# Altium project driver_display.PrjPcb
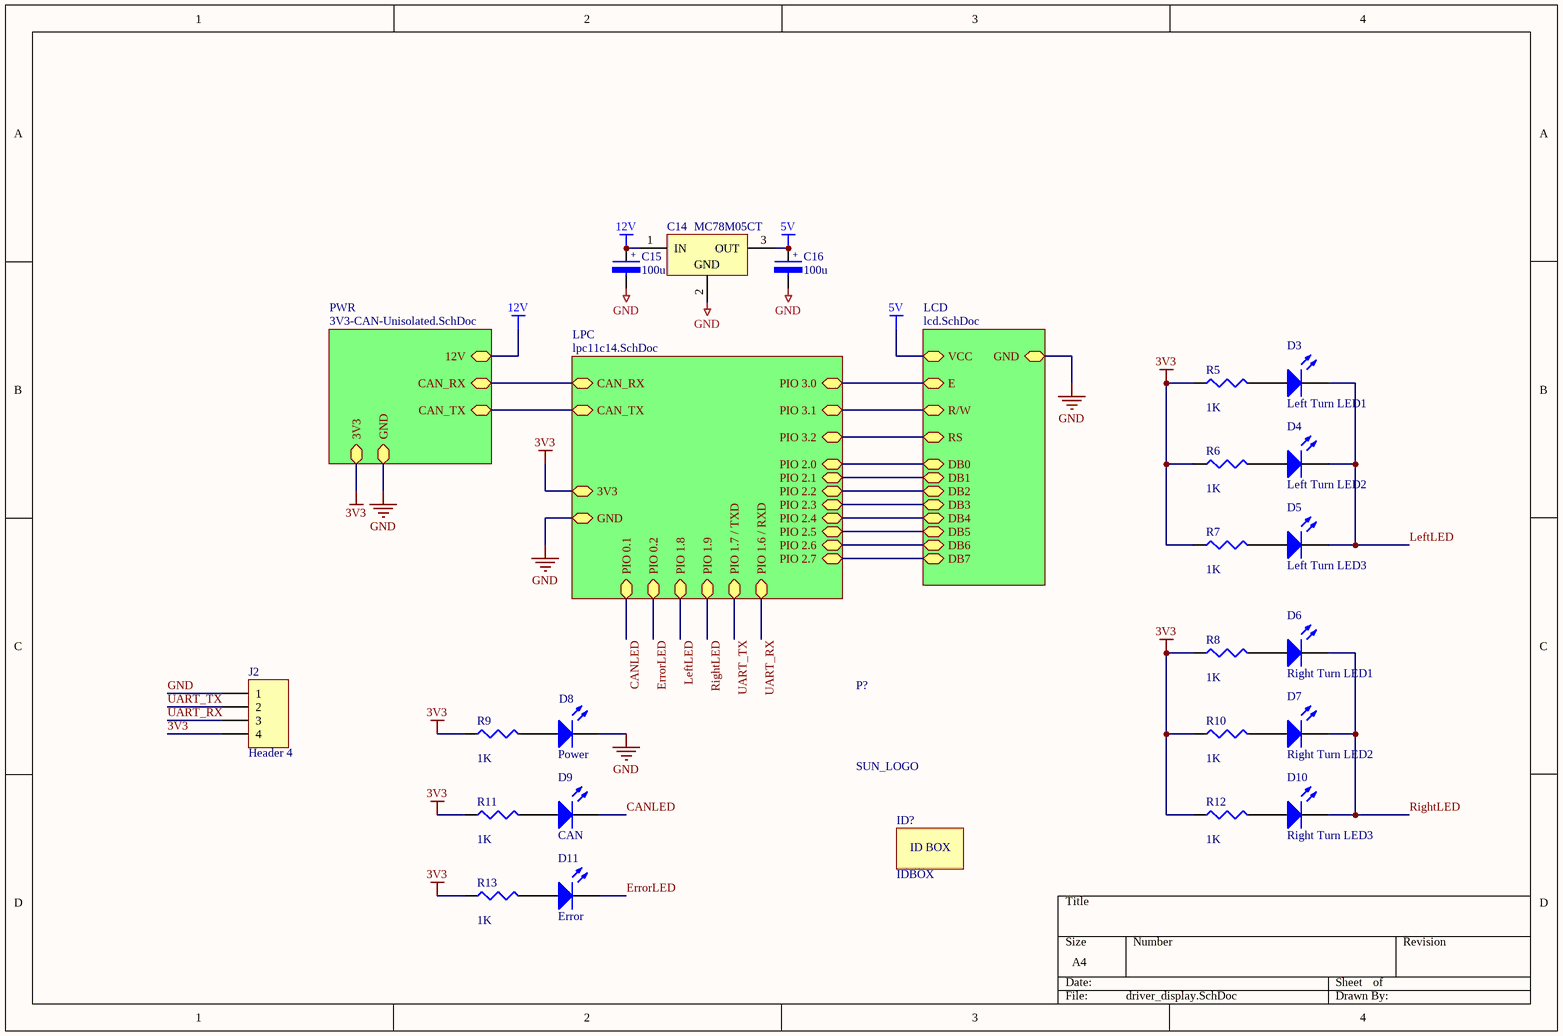
[diagram p0: driver_display.SchDoc]
5 sheets, 52 parts. Net scope: hierarchical (ports join the sheet entries above them; power ports are global).
Board file: driver_display.PcbDoc
Sheets:
  driver_display.SchDoc
    LPC = lpc11c14.SchDoc
    PWR = 3V3-CAN-Unisolated.SchDoc
      U_3V-Switcher-50mA = 3V-Switcher-50mA.SchDoc
    LCD = lcd.SchDoc

## Sheet driver_display.SchDoc
size A4

### Parts
(Parts that share a designator on the sheet are numbered #1, #2 ... from top to bottom, then left to right.)
C14  MC78M05CT  [7805]
C15  100u  [RAD-0.1]
C16  100u  [RAD-0.1]
D3  Left Turn LED1  [0805LED12]
D4  Left Turn LED2  [0805LED12]
D5  Left Turn LED3  [0805LED12]
D6  Right Turn LED1  [0805LED12]
D7  Right Turn LED2  [0805LED12]
D8  Power  [0805LED12]
D9  CAN  [0805LED12]
D10  Right Turn LED3  [0805LED12]
D11  Error  [0805LED12]
ID?  IDBOX  [IDBOX]
J2#1  Header 4  [HDR1X4]
P?  SUN_LOGO  [SUNSWIFTLOGO]
R5  value 1K  [0603]  (hidden comment: Left Turn 1)
R6  value 1K  [0603]  (hidden comment: Left Turn 2)
R7  value 1K  [0603]  (hidden comment: Left Turn 3)
R8  value 1K  [0603]  (hidden comment: Res3)
R9  value 1K  [0603]  (hidden comment: Res3)
R10  value 1K  [0603]  (hidden comment: Res3)
R11  value 1K  [0603]  (hidden comment: Res3)
R12  value 1K  [0603]  (hidden comment: Res3)
R13  value 1K  [0603]  (hidden comment: Res3)

### Sub-sheets
LCD = lcd.SchDoc: DB1, E, R/W, RS, DB0, DB2, DB3, DB4, DB5, DB6, DB7, VCC, GND
LPC = lpc11c14.SchDoc: CAN_RX, CAN_TX, PIO 3.0, PIO 2.5, PIO 2.3, PIO 2.1, PIO 3.2, PIO 3.1, PIO 2.7, PIO 2.4, PIO 2.6, PIO 2.0, PIO 2.2, 3V3, GND, PIO 0.1, PIO 0.2, PIO 1.8, PIO 1.9, PIO 1.7 / TXD, PIO 1.6 / RXD
PWR = 3V3-CAN-Unisolated.SchDoc: GND, CAN_RX, CAN_TX, 3V3, 12V

### Nets
3V3: J2#1.4 R5.1 R6.1 R7.1 R8.1 R9.1 R10.1 R11.1 R12.1 R13.1 ; sheet LPC/3V3, sheet PWR/3V3
5V: C14.3(OUT) C16.1 ; sheet LCD/VCC
12V: C14.1(IN) C15.1 ; sheet PWR/12V
GND: C14.2(GND) C15.2 C16.2 D8.2(K) J2#1.1 ; sheet LPC/GND, sheet PWR/GND, sheet LCD/GND
CANLED: D9.2(K) ; sheet LPC/PIO 0.1
ErrorLED: D11.2(K) ; sheet LPC/PIO 0.2
LeftLED: D3.2(K) D4.2(K) D5.2(K) ; sheet LPC/PIO 1.8
RightLED: D6.2(K) D7.2(K) D10.2(K) ; sheet LPC/PIO 1.9
UART_RX: J2#1.3 ; sheet LPC/PIO 1.6 / RXD
UART_TX: J2#1.2 ; sheet LPC/PIO 1.7 / TXD
NetD3_1: D3.1(A) R5.2
NetD4_1: D4.1(A) R6.2
NetD5_1: D5.1(A) R7.2
NetD6_1: D6.1(A) R8.2
NetD7_1: D7.1(A) R10.2
NetD8_1: D8.1(A) R9.2
NetD9_1: D9.1(A) R11.2
NetD10_1: D10.1(A) R12.2
NetD11_1: D11.1(A) R13.2
NetLCD_4: sheet LPC/PIO 3.2, sheet LCD/RS
NetLCD_5: sheet LPC/PIO 3.1, sheet LCD/R/W
NetLCD_6: sheet LPC/PIO 3.0, sheet LCD/E
NetLCD_7: sheet LPC/PIO 2.0, sheet LCD/DB0
NetLCD_8: sheet LPC/PIO 2.1, sheet LCD/DB1
NetLCD_9: sheet LPC/PIO 2.2, sheet LCD/DB2
NetLCD_10: sheet LPC/PIO 2.3, sheet LCD/DB3
NetLCD_11: sheet LPC/PIO 2.4, sheet LCD/DB4
NetLCD_12: sheet LPC/PIO 2.5, sheet LCD/DB5
NetLCD_13: sheet LPC/PIO 2.6, sheet LCD/DB6
NetLCD_14: sheet LPC/PIO 2.7, sheet LCD/DB7
NetU1_1: sheet LPC/CAN_TX, sheet PWR/CAN_TX
NetU1_4: sheet LPC/CAN_RX, sheet PWR/CAN_RX

### Notes on the sheet
- (in symbol CAP-POL) +
- (in symbol IDBOX) ID BOX

### Library data of the parts
C14 = MC78M05CT: 3-Terminal Medium-Current Positive Fixed Voltage Regulator; Note: Pin 2 is electrically connected to TAB; Code - JEDEC: TO-262-AA; Published: 17-Jul-2002; Datasheet: Linear and Interface Integrated Circuits, DL128 Rev2 (1988); Package Reference: 221A-04; Publisher: Altium Limited
C15 C16 = CAP-POL: Capacitor
D3-D11 = LED2: Typical RED, GREEN, YELLOW, AMBER GaAs LED; Published: 8-Jun-2000; LatestRevisionDate: 17-Jul-2002; LatestRevisionNote: Re-released for DXP Platform.; PackageVersion: Feb-2002; Publisher: Altium Limited; PackageDescription: SM LED; 2 Flat Leads
  D8 D9 D11: PackageReference: 3.2X1.6X1.1
J2#1 = Header 4: Header, 4-Pin; LatestRevisionDate: 17-Jul-2002; LatestRevisionNote: Re-released for DXP Platform.; Publisher: Altium Limited
R5-R13 = Res3: Resistor; Published: 8-Jun-2000; LatestRevisionDate: 29-May-2009; LatestRevisionNote: IPC-7351 Footprint Added.; PackageReference: J1-0603; Publisher: Altium Limited; PackageDescription: Chip Resistor

## Sheet lpc11c14.SchDoc
size A4; Organization: UNSW Solar Racing Team; Address3: UNSW; Address4: Sydney NSW 2052; Address2: Electrical Engineering; Address1: Rm 109
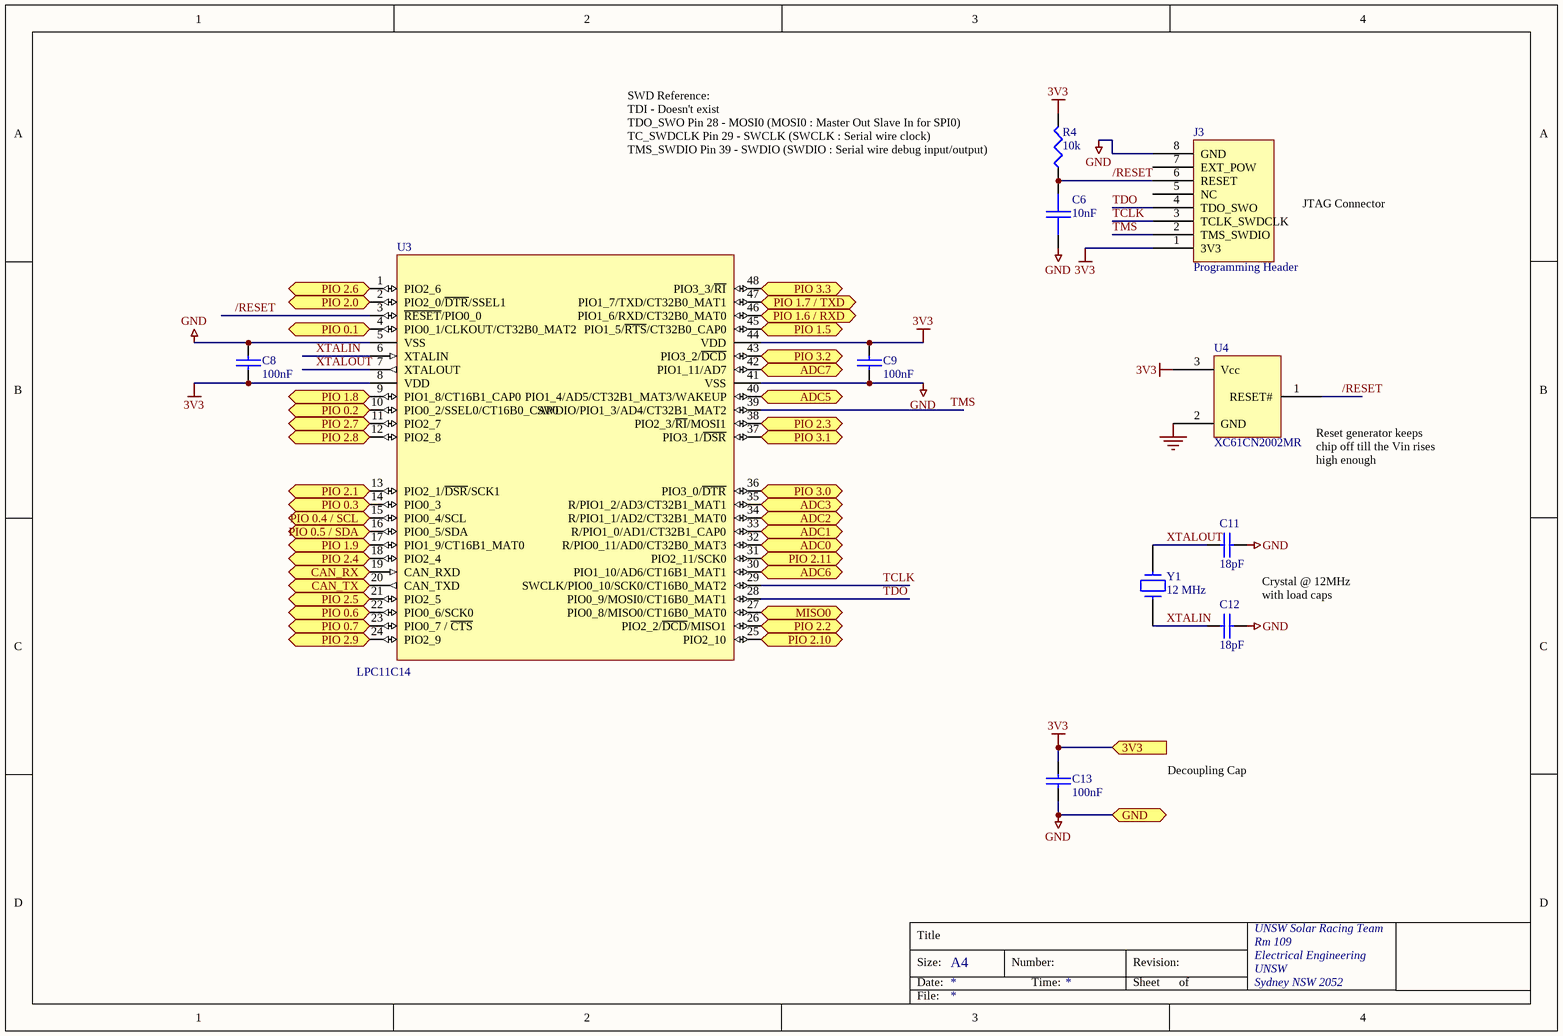
[diagram p1: lpc11c14.SchDoc]

### Parts
C6  10nF  [0603]
C8  100nF  [0603]
C9  100nF  [0603]
C11  18pF  [0603]
C12  18pF  [0603]
C13  100nF  [0603]
J3  Programming Header  [IDC8]
R4  10k  [0603]
U3  LPC11C14  [QFP48]
U4  XC61CN2002MR  [SOT23-3]
Y1  12 MHz  [HC49/4H]

### Ports
3V3, ADC0 (in), ADC1 (in), ADC2 (in), ADC3 (in), ADC5 (in), ADC6 (in), ADC7 (in), CAN_RX (in), CAN_TX (out), GND, MISO0, PIO 0.1 (bidir), PIO 0.2 (bidir), PIO 0.3 (bidir), PIO 0.4 / SCL (bidir), PIO 0.5 / SDA (bidir), PIO 0.6 (bidir), PIO 0.7 (bidir), PIO 1.5 (bidir), PIO 1.6 / RXD (bidir), PIO 1.7 / TXD (bidir), PIO 1.8 (bidir), PIO 1.9 (bidir), PIO 2.0 (bidir), PIO 2.1 (bidir), PIO 2.2 (bidir), PIO 2.3 (bidir), PIO 2.4 (bidir), PIO 2.5 (bidir), PIO 2.6 (bidir), PIO 2.7 (bidir), PIO 2.8 (bidir), PIO 2.9 (bidir), PIO 2.10 (bidir), PIO 2.11 (bidir), PIO 3.0 (bidir), PIO 3.1 (bidir), PIO 3.2 (bidir), PIO 3.3 (bidir)

### Nets
3V3: C8.2 C9.1 C13.1 J3.1(3V3) R4.2 U3.8(VDD) U3.44(VDD) U4.3(Vcc) ; port 3V3
GND: C6.2 C8.1 C9.2 C11.2 C12.2 C13.2 J3.8(GND) U3.5(VSS) U3.41(VSS) U4.2(GND) ; port GND
/RESET: C6.1 J3.6(RESET) R4.1 U3.3(~{RESET}/PIO0_0) U4.1(RESET#)
CANLED: U3.4(PIO0_1/CLKOUT/CT32B0_MAT2) ; port PIO 0.1
ErrorLED: U3.10(PIO0_2/SSEL0/CT16B0_CAP0) ; port PIO 0.2
LeftLED: U3.9(PIO1_8/CT16B1_CAP0) ; port PIO 1.8
RightLED: U3.17(PIO1_9/CT16B1_MAT0) ; port PIO 1.9
TCLK: J3.3(TCLK_SWDCLK) U3.29(SWCLK/PIO0_10/SCK0/CT16B0_MAT2)
TDO: J3.4(TDO_SWO) U3.28(PIO0_9/MOSI0/CT16B0_MAT1)
TMS: J3.2(TMS_SWDIO) U3.39(SWDIO/PIO1_3/AD4/CT32B1_MAT2)
UART_RX: U3.46(PIO1_6/RXD/CT32B0_MAT0) ; port PIO 1.6 / RXD
UART_TX: U3.47(PIO1_7/TXD/CT32B0_MAT1) ; port PIO 1.7 / TXD
XTALIN: C12.1 U3.6(XTALIN) Y1.1
XTALOUT: C11.1 U3.7(XTALOUT) Y1.2
NetLCD_4: U3.43(PIO3_2/~{DCD}) ; port PIO 3.2
NetLCD_5: U3.37(PIO3_1/~{DSR}) ; port PIO 3.1
NetLCD_6: U3.36(PIO3_0/~{DTR}) ; port PIO 3.0
NetLCD_7: U3.2(PIO2_0/~{DTR}/SSEL1) ; port PIO 2.0
NetLCD_8: U3.13(PIO2_1/~{DSR}/SCK1) ; port PIO 2.1
NetLCD_9: U3.26(PIO2_2/~{DCD}/MISO1) ; port PIO 2.2
NetLCD_10: U3.38(PIO2_3/~{RI}/MOSI1) ; port PIO 2.3
NetLCD_11: U3.18(PIO2_4) ; port PIO 2.4
NetLCD_12: U3.21(PIO2_5) ; port PIO 2.5
NetLCD_13: U3.1(PIO2_6) ; port PIO 2.6
NetLCD_14: U3.11(PIO2_7) ; port PIO 2.7
NetU1_1: U3.20(CAN_TXD) ; port CAN_TX
NetU1_4: U3.19(CAN_RXD) ; port CAN_RX
NetU3_12: U3.12(PIO2_8) ; port PIO 2.8
NetU3_14: U3.14(PIO0_3) ; port PIO 0.3
NetU3_15: U3.15(PIO0_4/SCL) ; port PIO 0.4 / SCL
NetU3_16: U3.16(PIO0_5/SDA) ; port PIO 0.5 / SDA
NetU3_22: U3.22(PIO0_6/SCK0) ; port PIO 0.6
NetU3_23: U3.23(PIO0_7_/_~{CTS}) ; port PIO 0.7
NetU3_24: U3.24(PIO2_9) ; port PIO 2.9
NetU3_25: U3.25(PIO2_10) ; port PIO 2.10
NetU3_27: U3.27(PIO0_8/MISO0/CT16B0_MAT0) ; port MISO0
NetU3_30: U3.30(PIO1_10/AD6/CT16B1_MAT1) ; port ADC6
NetU3_31: U3.31(PIO2_11/SCK0) ; port PIO 2.11
NetU3_32: U3.32(R/PIO0_11/AD0/CT32B0_MAT3) ; port ADC0
NetU3_33: U3.33(R/PIO1_0/AD1/CT32B1_CAP0) ; port ADC1
NetU3_34: U3.34(R/PIO1_1/AD2/CT32B1_MAT0) ; port ADC2
NetU3_35: U3.35(R/PIO1_2/AD3/CT32B1_MAT1) ; port ADC3
NetU3_40: U3.40(PIO1_4/AD5/CT32B1_MAT3/WAKEUP) ; port ADC5
NetU3_42: U3.42(PIO1_11/AD7) ; port ADC7
NetU3_45: U3.45(PIO1_5/~{RTS}/CT32B0_CAP0) ; port PIO 1.5
NetU3_48: U3.48(PIO3_3/~{RI}) ; port PIO 3.3

Not connected (* = marked no-connect by the designer): J3 5(NC) 7(EXT_POW)

### Notes on the sheet
- SWD Reference:
  TDI - Doesn't exist
  TDO_SWO Pin 28 - MOSI0 (MOSI0 : Master Out Slave In for SPI0)
  TC_SWDCLK Pin 29 - SWCLK (SWCLK : Serial wire clock)
  TMS_SWDIO Pin 39 - SWDIO (SWDIO : Serial wire debug input/output)
- JTAG Connector
- (near U4) Reset generator keeps chip off till the Vin rises high enough
- Crystal @ 12MHz with load caps
- Decoupling Cap
- Title
- Size:
- Date:
- A4
- Number:
- Time:
- Revision:
- Sheet
- of
- File:

### Library data of the parts
C6 C8 C9 C13 = CAP: Capacitor; Needed?: NO - HW LAB
  C6: Value: 10nF
  C8 C9 C13: Value: 100nF
C11 C12 = CAP: Capacitor; Needed?: Farnell; Value: 18pF; Farnell: 1844169; Farnell Price: 0.025
J3 = LPCLink_Connector: LPC SWD Connector; Needed?: NO - Common
R4 = RES1: Resistor; Needed?: NO - HW LAB; Value: 10k
U3 = LPC11C14_Full: Needed?: Farnell; Farnell: 1812185; Farnell Price: 8.38
U4 = XC61F: SOT23 reset generator; Needed?: Farnell; Farnell: 3605486; Farnell Price: 1.74
Y1 = CRYSTAL: Needed?: RS; RS: 693-8803; RS Price: 0.95

## Sheet 3V3-CAN-Unisolated.SchDoc
size A4; Organization: UNSW Solar Racing Team; Address3: UNSW; Address4: Sydney NSW 2052; Address2: Electrical Engineering; Address1: Rm 109
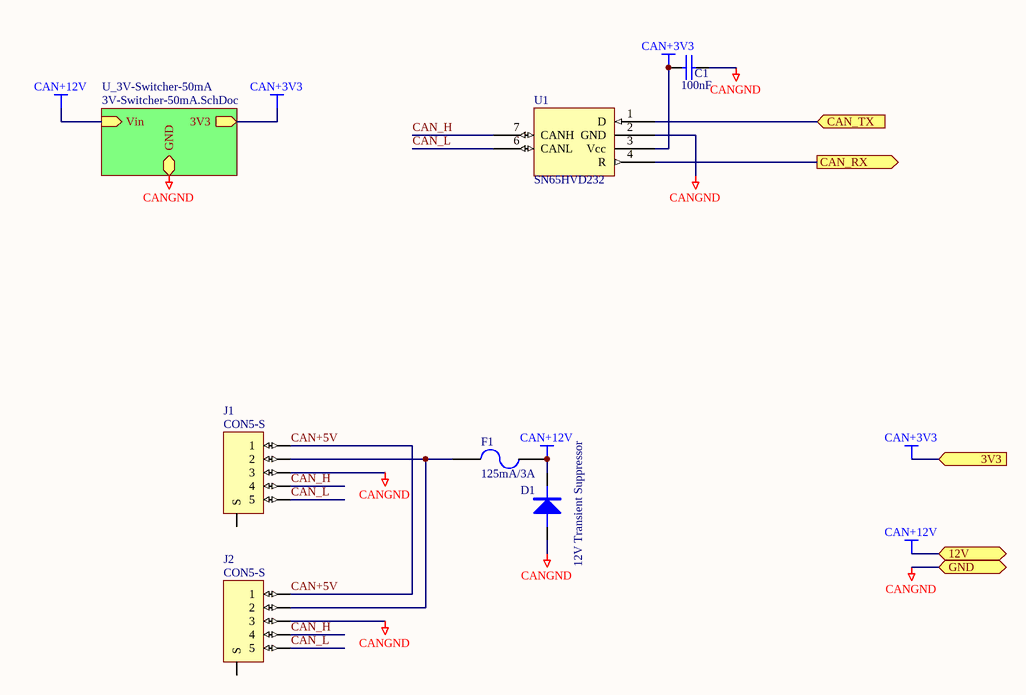
[diagram p2: 3V3-CAN-Unisolated.SchDoc]

### Parts
(Parts that share a designator on the sheet are numbered #1, #2 ... from top to bottom, then left to right.)
C1  100nF  [0603]
D1  12V Transient Suppressor  [SMA]
F1  125mA/3A  [LITTELFUSE-154]
J1  CON5-S  [TRIAD5F]
J2#2  CON5-S  [TRIAD5F]
U1  SN65HVD232  [SO8]

### Sub-sheets
U_3V-Switcher-50mA = 3V-Switcher-50mA.SchDoc: GND, 3V3, Vin

### Ports
3V3, 12V, CAN_RX (out), CAN_TX (in), GND

### Nets
CAN+3V3: C1.2 U1.3(Vcc) ; port 3V3, sheet U_3V-Switcher-50mA/3V3  [project net 3V3]
CAN+12V: D1.K F1.2 ; port 12V, sheet U_3V-Switcher-50mA/Vin  [project net 12V]
CANGND: C1.1 D1.A J1.3 J2#2.3 U1.2(GND) ; port GND, sheet U_3V-Switcher-50mA/GND  [project net GND]
CAN+5V: J1.1 J2#2.1
CAN_H: J1.4 J2#2.4 U1.7(CANH)
CAN_L: J1.5 J2#2.5 U1.6(CANL)
NetF1_1: F1.1 J1.2 J2#2.2
NetU1_1: U1.1(D) ; port CAN_TX
NetU1_4: U1.4(R) ; port CAN_RX

Not connected (* = marked no-connect by the designer): J1 0(S); J2#2 0(S)

### Notes on the sheet
- Title
- Size:
- Date:
- A4
- Number:
- Time:
- Revision:
- Sheet
- of
- File:

### Library data of the parts
C1 = CAP: Capacitor; Needed?: NO - HW LAB; Value: 100nF
D1 = DIODE: Needed?: NO - Workshop; Farnell: 302-3096; Farnell Price: 1.25
F1 = FUSE2: Fuse; Needed?: NO - Workshop; Farnell: 664-893; Other Info: www.littelfuse.com; Farnell Price: 5.67
J1 J2#2 = CON5-S: Connector, 2 pin, with shield @ S; Needed?: NO - Workshop; Farnell Price: 19.32
U1 = SN65HVD232: 3.3V CAN Transciever; Needed?: Unsure - RS; RS: 461-9771; RS Price: 3.81; Farnell: 1103107; Farnell Price: 5.10

## Sheet 3V-Switcher-50mA.SchDoc
size A4; Organization: UNSW Solar Racing Team; Address3: UNSW; Address4: Sydney NSW 2052; Address2: Electrical Engineering; Address1: Rm 109
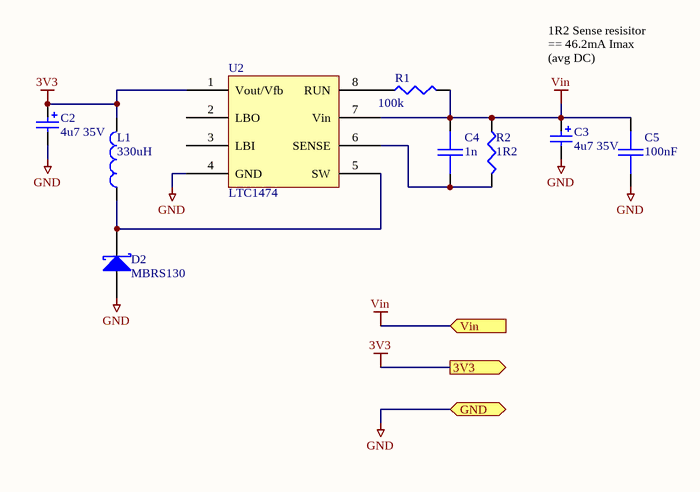
[diagram p3: 3V-Switcher-50mA.SchDoc]

### Parts
C2  4u7 35V  [MCCT-CASEC]
C3  4u7 35V  [MCCT-CASEC]
C4  1n  [0603]
C5  100nF  [0603]
D2  MBRS130  [SMB]
L1  330uH  [1812]
R1  100k  [0603]
R2  1R2  [0603]
U2  LTC1474  [SO8]

### Ports
3V3, GND, Vin (in)

### Nets
3V3: C2.1 L1.2 U2.1(Vout/Vfb) ; port 3V3
GND: C2.2 C3.2 C5.2 D2.A U2.4(GND) ; port GND
Vin: C3.1 C4.1 C5.1 R1.2 R2.1 U2.7(Vin) ; port Vin  [project net 12V]
NetC4_2: C4.2 R2.2 U2.6(SENSE)
NetD2_K: D2.K L1.1 U2.5(SW)
NetR1_1: R1.1 U2.8(RUN)

Not connected (* = marked no-connect by the designer): U2 2(LBO) 3(LBI)

### Notes on the sheet
- 1R2 Sense resisitor == 46.2mA Imax (avg DC)
- Title
- Size:
- Date:
- A4
- Number:
- Time:
- Revision:
- Sheet
- of
- File:

### Library data of the parts
C2 C3 = Cap Pol3: Polarized Capacitor (Surface Mount); Value: 4.7uF; Needed?: Farnell; Revision: July-2002: Re-released for DXP Platform.; Farnell: 1844256; Farnell Price: 0.075
C4 = CAP: Capacitor; Value: 1nF; Needed?: NO - HW LAB; Revision: July-2002: Re-released for DXP Platform.
C5 = CAP: Capacitor; Needed?: NO - HW LAB; Revision: July-2002: Re-released for DXP Platform.; Value: 100nF
D2 = D SCHOTTKY: Schottky Diode; Needed?: Unsure - RS; RS: 625-5278; RS Price: 0.39; Revision: July-2002: Re-released for DXP Platform.; Farnell: 708-150; Farnell Price: 2.09
L1 = Inductor: Needed?: Not Used; Revision: July-2002: Re-released for DXP Platform.; Value: 330uH; Farnell: 200-451; Farnell Price: 2.90
R1 = RES1: Resistor; Needed?: NO - HW LAB; Value: 100k
R2 = RES1: Resistor; Value: 1.2R; Needed?: Farnell; Revision: July-2002: Re-released for DXP Platform.; Farnell: 1811627; Farnell Price: 0.044
U2 = LTC1474: Step-down converter; Needed?: Not Used

## Sheet lcd.SchDoc
size A4
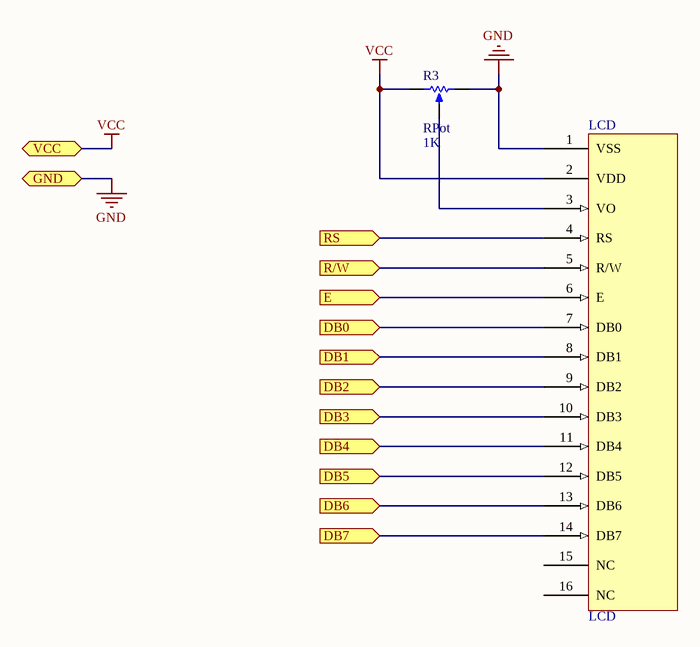
[diagram p4: lcd.SchDoc]

### Parts
LCD  LCD  [IDC16]
R3  RPot  value 1K  [trimpot]

### Ports
DB0 (in), DB1 (in), DB2 (in), DB3 (in), DB4 (in), DB5 (in), DB6 (in), DB7 (in), E (in), GND, R/W (in), RS (in), VCC

### Nets
GND: LCD.1(VSS) R3.2(BOT) ; port GND
VCC: LCD.2(VDD) R3.1(TOP) ; port VCC  [project net 5V]
NetLCD_3: LCD.3(VO) R3.3(TAP)
NetLCD_4: LCD.4(RS) ; port RS
NetLCD_5: LCD.5(R/W) ; port R/W
NetLCD_6: LCD.6(E) ; port E
NetLCD_7: LCD.7(DB0) ; port DB0
NetLCD_8: LCD.8(DB1) ; port DB1
NetLCD_9: LCD.9(DB2) ; port DB2
NetLCD_10: LCD.10(DB3) ; port DB3
NetLCD_11: LCD.11(DB4) ; port DB4
NetLCD_12: LCD.12(DB5) ; port DB5
NetLCD_13: LCD.13(DB6) ; port DB6
NetLCD_14: LCD.14(DB7) ; port DB7

Not connected (* = marked no-connect by the designer): LCD 15(NC) 16(NC)

### Library data of the parts
R3 = RPot: Potentiometer; Sim Note: Enter the Resistance value and the set point into parameter fields.; Set Position: 0.5; RS: 522-1016; Published: 8-Jun-2000; LatestRevisionDate: 17-Jul-2002; LatestRevisionNote: Re-released for DXP Platform.; PackageReference: VR5; Publisher: Altium Limited; PackageDescription: Variable Resistor, Thru-Hole; 3 Leads

## Nets that join several sheets
3V3: driver_display (10 pins), lpc11c14 (8 pins), 3V3-CAN-Unisolated (C1.2 U1.3), 3V-Switcher-50mA (C2.1 L1.2 U2.1)
5V: driver_display (C14.3 C16.1), lcd (LCD.2 R3.1)
12V: driver_display (C14.1 C15.1), 3V3-CAN-Unisolated (D1.K F1.2), 3V-Switcher-50mA (6 pins)
GND: driver_display (5 pins), lpc11c14 (10 pins), 3V3-CAN-Unisolated (5 pins), 3V-Switcher-50mA (5 pins), lcd (LCD.1 R3.2)
CANLED: driver_display (D9.2), lpc11c14 (U3.4)
ErrorLED: driver_display (D11.2), lpc11c14 (U3.10)
LeftLED: driver_display (D3.2 D4.2 D5.2), lpc11c14 (U3.9)
NetLCD_4: lpc11c14 (U3.43), lcd (LCD.4)
NetLCD_5: lpc11c14 (U3.37), lcd (LCD.5)
NetLCD_6: lpc11c14 (U3.36), lcd (LCD.6)
NetLCD_7: lpc11c14 (U3.2), lcd (LCD.7)
NetLCD_8: lpc11c14 (U3.13), lcd (LCD.8)
NetLCD_9: lpc11c14 (U3.26), lcd (LCD.9)
NetLCD_10: lpc11c14 (U3.38), lcd (LCD.10)
NetLCD_11: lpc11c14 (U3.18), lcd (LCD.11)
NetLCD_12: lpc11c14 (U3.21), lcd (LCD.12)
NetLCD_13: lpc11c14 (U3.1), lcd (LCD.13)
NetLCD_14: lpc11c14 (U3.11), lcd (LCD.14)
NetU1_1: lpc11c14 (U3.20), 3V3-CAN-Unisolated (U1.1)
NetU1_4: lpc11c14 (U3.19), 3V3-CAN-Unisolated (U1.4)
RightLED: driver_display (D6.2 D7.2 D10.2), lpc11c14 (U3.17)
UART_RX: driver_display (J2#1.3), lpc11c14 (U3.46)
UART_TX: driver_display (J2#1.2), lpc11c14 (U3.47)